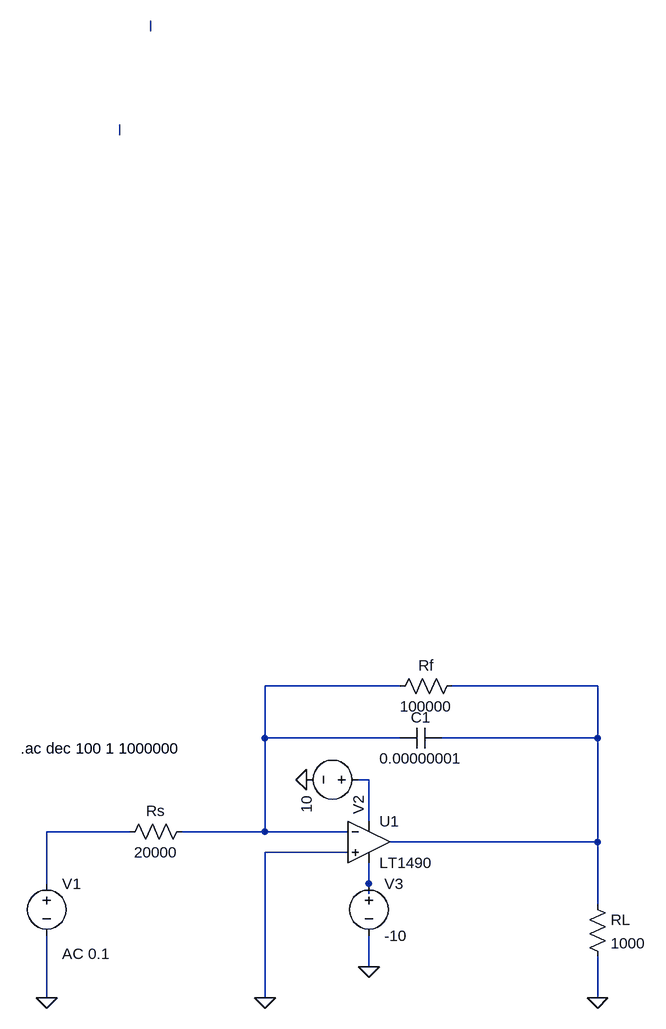
[diagram p0: schematic 11-14.asc]
11-14.asc, the LTspice schematic file:
Version 4
SHEET 1 980 680
WIRE 208 -1248 208 -1264
WIRE 160 -1088 160 -1104
WIRE 592 -240 384 -240
WIRE 896 -240 672 -240
WIRE 384 -160 384 -240
WIRE 592 -160 384 -160
WIRE 896 -160 896 -240
WIRE 896 -160 656 -160
WIRE 544 -96 528 -96
WIRE 544 -32 544 -96
WIRE 176 -16 48 -16
WIRE 384 -16 384 -160
WIRE 384 -16 256 -16
WIRE 512 -16 384 -16
WIRE 896 0 896 -160
WIRE 896 0 576 0
WIRE 512 16 384 16
WIRE 48 64 48 -16
WIRE 544 64 544 32
WIRE 544 80 544 64
WIRE 896 96 896 0
WIRE 544 192 544 144
WIRE 48 240 48 144
WIRE 384 240 384 16
WIRE 896 240 896 176
FLAG 896 240 0
FLAG 384 240 0
FLAG 48 240 0
FLAG 544 192 0
FLAG 448 -96 0
SYMBOL voltage 48 48 R0
WINDOW 123 24 124 Left 2
WINDOW 39 0 0 Left 0
SYMATTR Value2 AC 0.1
SYMATTR InstName V1
SYMATTR Value ""
SYMBOL res 272 -32 R90
WINDOW 0 0 56 VBottom 2
WINDOW 3 32 56 VTop 2
SYMATTR InstName Rs
SYMATTR Value 20000
SYMBOL res 688 -256 R90
WINDOW 0 0 56 VBottom 2
WINDOW 3 32 56 VTop 2
SYMATTR InstName Rf
SYMATTR Value 100000
SYMBOL cap 656 -176 R90
WINDOW 0 0 32 VBottom 2
WINDOW 3 32 32 VTop 2
SYMATTR InstName C1
SYMATTR Value 0.00000001
SYMBOL OpAmps\\LT1490 544 -64 R0
SYMATTR InstName U1
SYMBOL res 880 80 R0
SYMATTR InstName RL
SYMATTR Value 1000
SYMBOL voltage 544 -96 R90
WINDOW 123 0 0 Left 0
WINDOW 39 0 0 Left 0
SYMATTR InstName V2
SYMATTR Value 10
SYMBOL voltage 544 48 R0
WINDOW 123 0 0 Left 0
WINDOW 39 0 0 Left 0
SYMATTR InstName V3
SYMATTR Value -10
TEXT 8 -144 Left 2 !.ac dec 100 1 1000000

The netlist it stands for:
* 11-14.asc
V1 N006 0 AC 0.1
Rs N003 N006 20000
Rf N004 N003 100000
C1 N004 N003 0.00000001
XU1 0 N003 N005 N007 N004 LT1490  ; pins In+ In- V+ V- OUT
RL N004 0 1000
V2 N005 0 10
V3 N007 0 -10
.ac dec 100 1 1000000
.backanno
.end